# EAGLE design taserv2 (EAGLE 9.6.2)

## Sheet 1 of 3: Boost controller
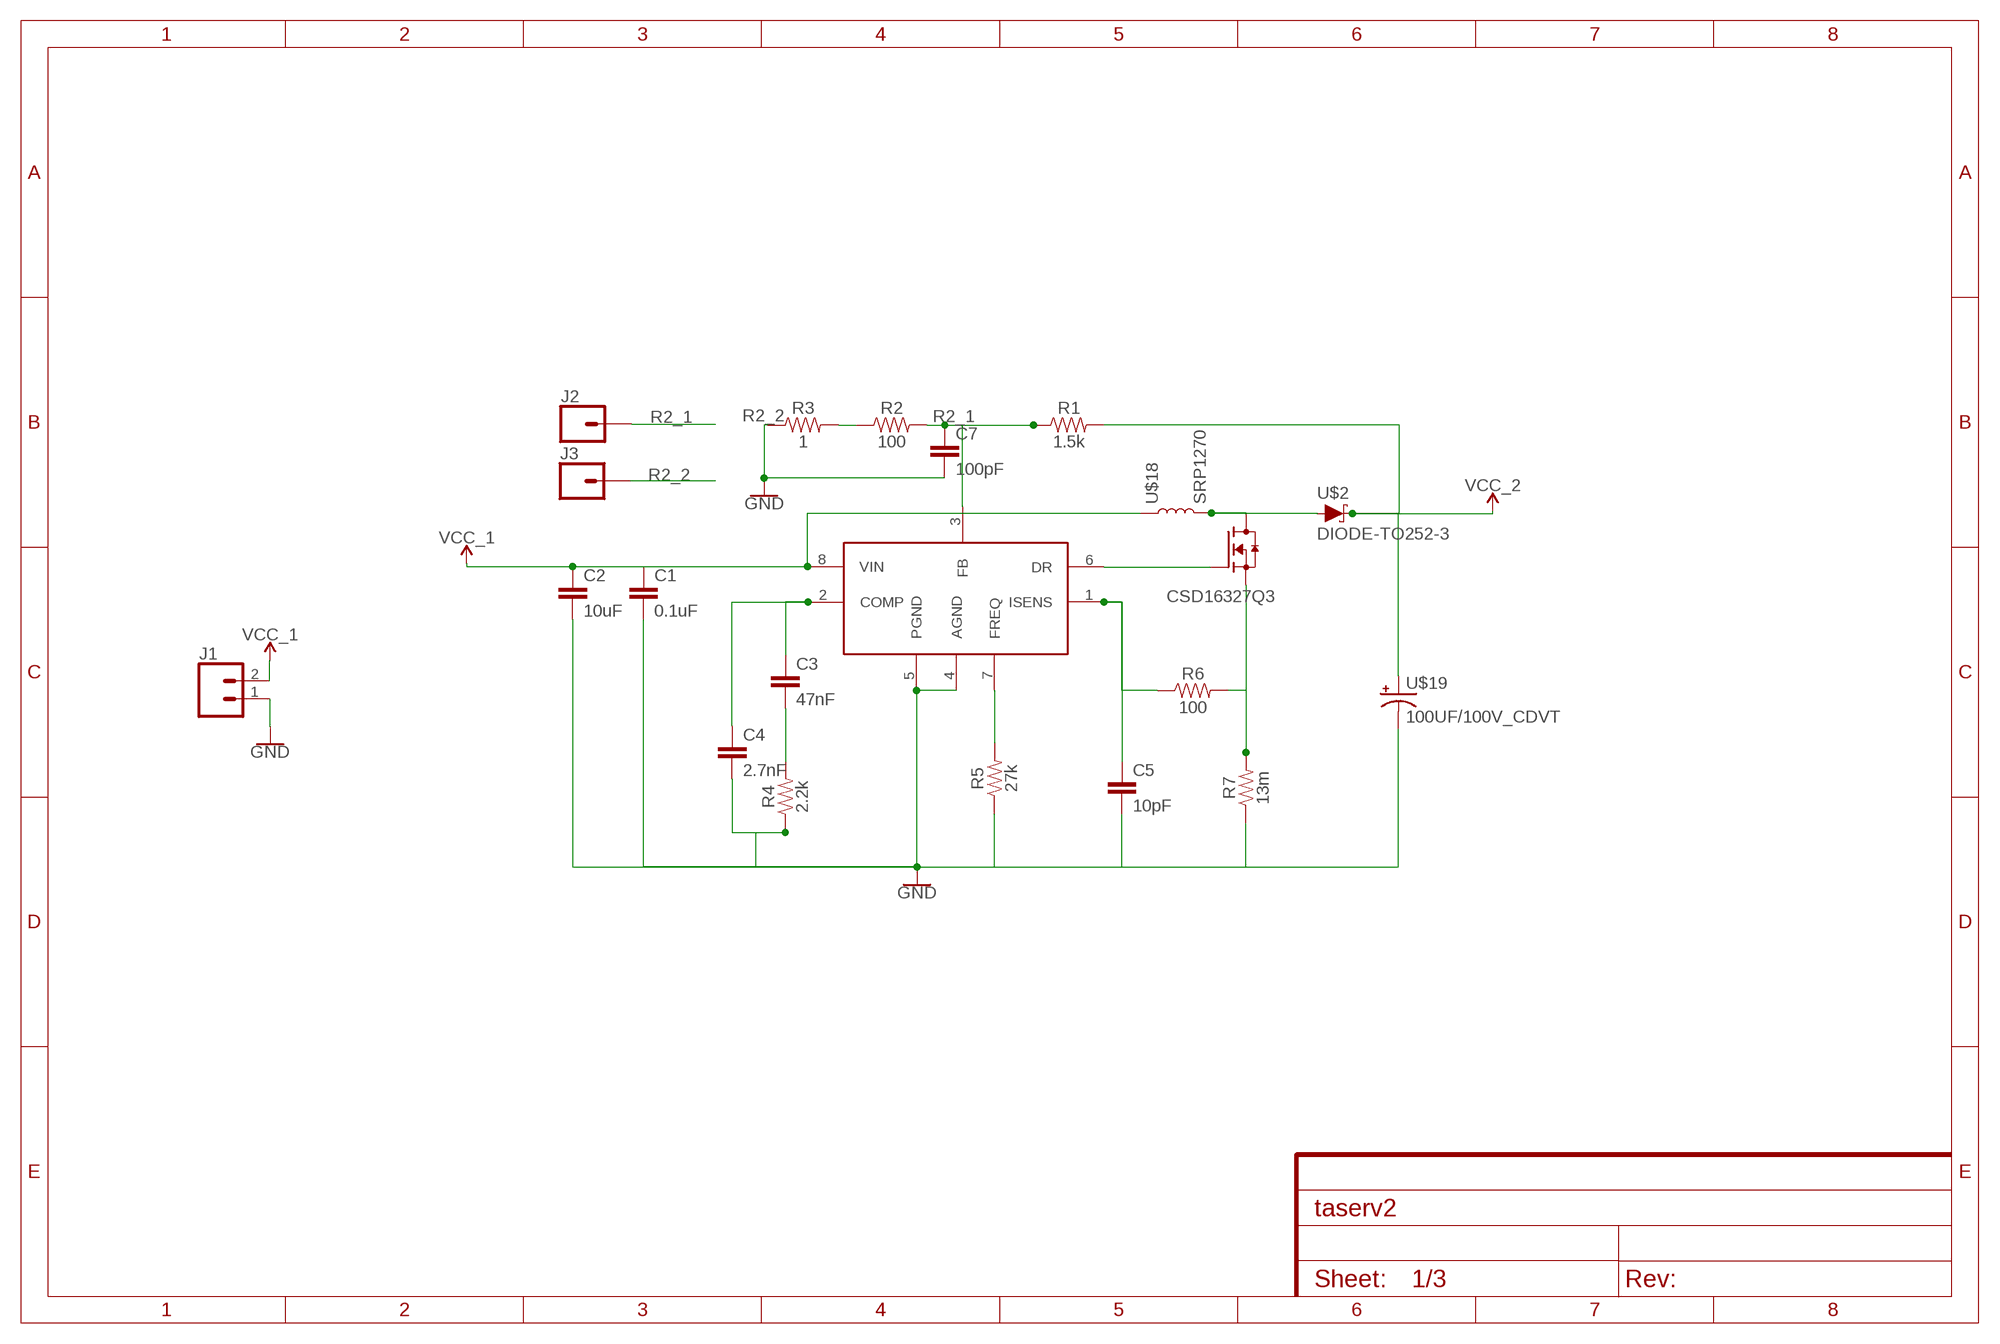
[diagram p0: schematic, sheet 1]

### Parts
C1  0.1uF  0.1UF-0603-25V-(+80/-20%)  [0603]
C2  10uF  0.1UF-0603-25V-(+80/-20%)  [0603]
C3  47nF  1.0UF-1206-50V-10%  [1206]
C4  2.7nF  1.0UF-0603-16V-10%  [0603]
C5  10pF  0.1UF-0603-25V-5%  [0603]
C7  100pF  0.1UF-0603-25V-(+80/-20%)  [0603]
J1  CONN_02LOCK  [1X02_LOCK]
J2  CONN_01  [1X01]
J3  CONN_01  [1X01]
Q1  CSD16327Q3  [TRANS_CSD16327Q3]
R1  1.5k  0.27OHM-0603-1/10W-1%  [0603]
R2  100  0.27OHM-0603-1/10W-1%  [0603]
R3  1  0.27OHM-0603-1/10W-1%  [0603]
R4  2.2k  2.2KOHM-0603-1/10W-1%  [0603]
R5  27k  2.2KOHM-0603-1/10W-1%  [0603]
R6  100  1.5KOHM-0603-1/10W-1%  [0603]
R7  13m  1.5KOHM-0603-1/10W-1%  [0603]
U$1  LM3478  [SOIC-8]
U$2  DIODE-TO252-3  [DPAK]
U$18  SRP1270  [SRP1270]
U$19  100UF/100V_CDVT  [100UF/100V_CDVT]

### Nets
GND: C1.2 C2.2 C4.2 C5.2 J1.1 R4.1 R5.1 R7.1 U$1.4(AGND) U$1.5(PGND) U$19.P$2(-) ; also sheet 2,3
N$1: C3.1 C4.1 U$1.2(COMP)
N$2: C3.2 R4.2
N$3: R5.2 U$1.7(FREQ)
N$4: R2.1 R3.2
N$6: Q1.4(G) U$1.6(DR)
N$7: Q1.1(S) Q1.2(S) Q1.3(S) R6.2 R7.2
N$8: C5.1 R6.1 U$1.1(ISENS)
N$10: Q1.5-8(D) U$2.1(A) U$2.3(A) U$18.P$2
R2_1: C7.1 J2.1 R1.1 R2.2 U$1.3(FB)
R2_2: C7.2 J3.1 R3.1 ; supply symbol labelled GND
VCC_1: C1.1 C2.1 J1.2 U$1.8(VIN) U$18.P$1
VCC_2: R1.2 U$2.4(C) U$19.P$1(+) ; also sheet 2

## Sheet 2 of 3: ZVS driver
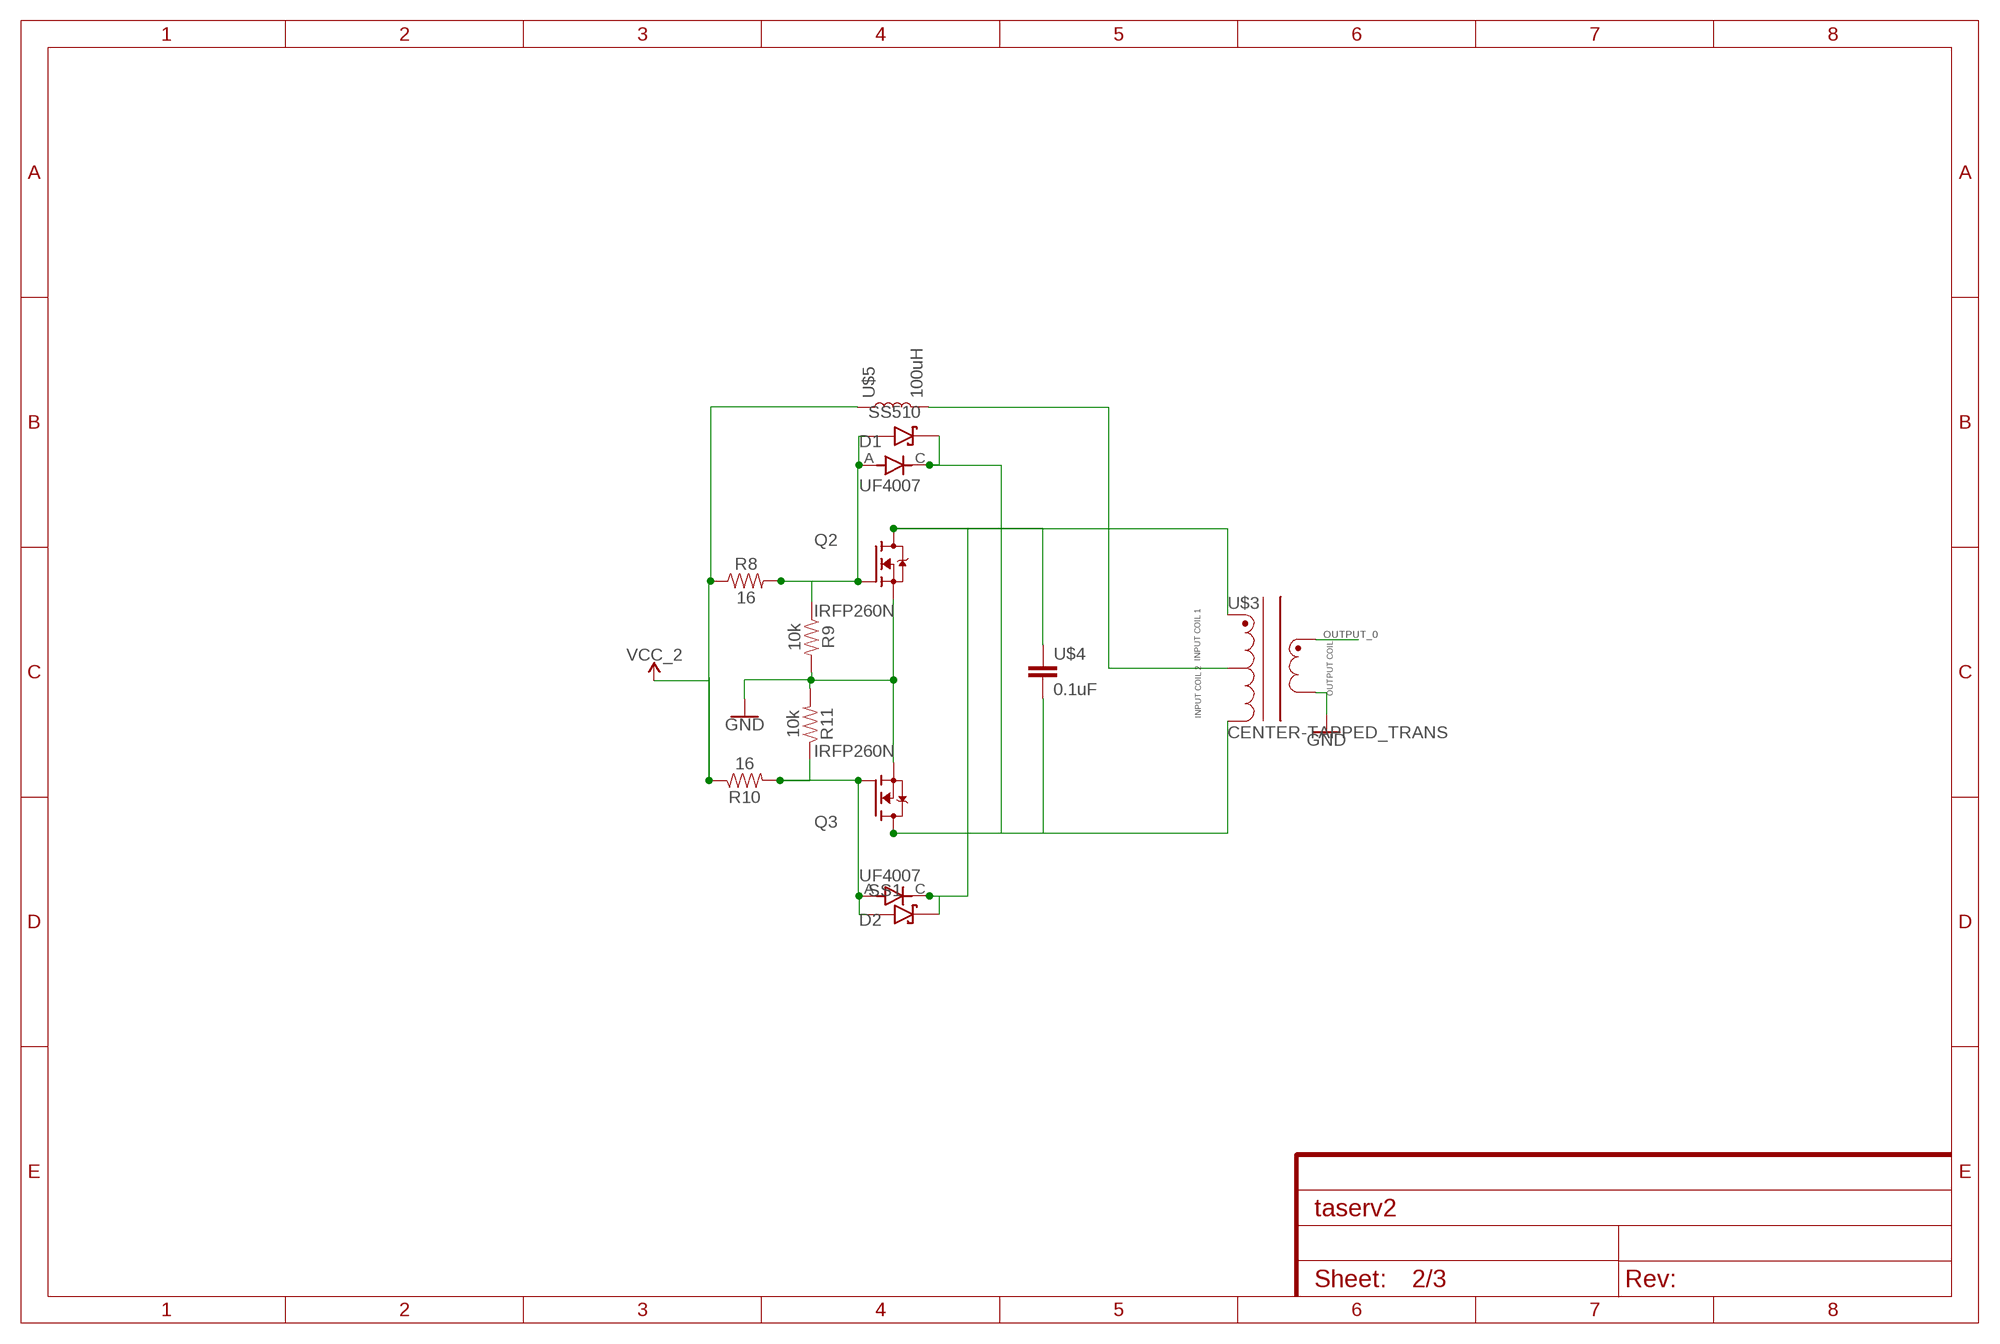
[diagram p1: schematic, sheet 2]

### Parts
D1  UF4007  [DIOAD1036W78L520D274]
D2  UF4007  [DIOAD1036W78L520D274]
Q2  IRFP260N  [TO545P1560X500X2460-3]
Q3  IRFP260N  [TO545P1560X500X2460-3]
R8  16  1KOHM-0603-1/10W-1%  [0603]
R9  10k  1KOHM-0603-1/10W-1%  [0603]
R10  16  1KOHM-0603-1/10W-1%  [0603]
R11  10k  1KOHM-0603-1/10W-1%  [0603]
SS1  MBRS340T3G  [DIOM7959X261N]
SS510  MBRS340T3G  [DIOM7959X261N]
U$3  CENTER-TAPPED_TRANS  [CENTER-TAPPED_TRANS]
U$4  0.1uF  MKP4  [MKP_CAP]
U$5  100uH  STANDARD_100UH  [1X04_LOCK]

### Nets
GND: Q2.3(S) Q3.3(S) R9.2 R11.2 U$3.5 ; also sheet 1,3
N$5: D2.C(K) Q2.2(D) SS1.C(K) U$3.3 U$4.1
N$9: D1.A Q2.1(G) R8.2 R9.1 SS510.A
N$11: D2.A Q3.1(G) R10.2 R11.1 SS1.A
N$14: D1.C(K) Q3.2(D) SS510.C(K) U$3.1 U$4.5
N$15: U$3.2 U$5.4
OUTPUT_0: U$3.4 ; also sheet 3
VCC_2: R8.1 R10.1 U$5.1 ; also sheet 1

### Notes on the sheet
- INPUT COIL 1
- OUTPUT COIL
- INPUT COIL 2

## Sheet 3 of 3: Cockroft-Walton
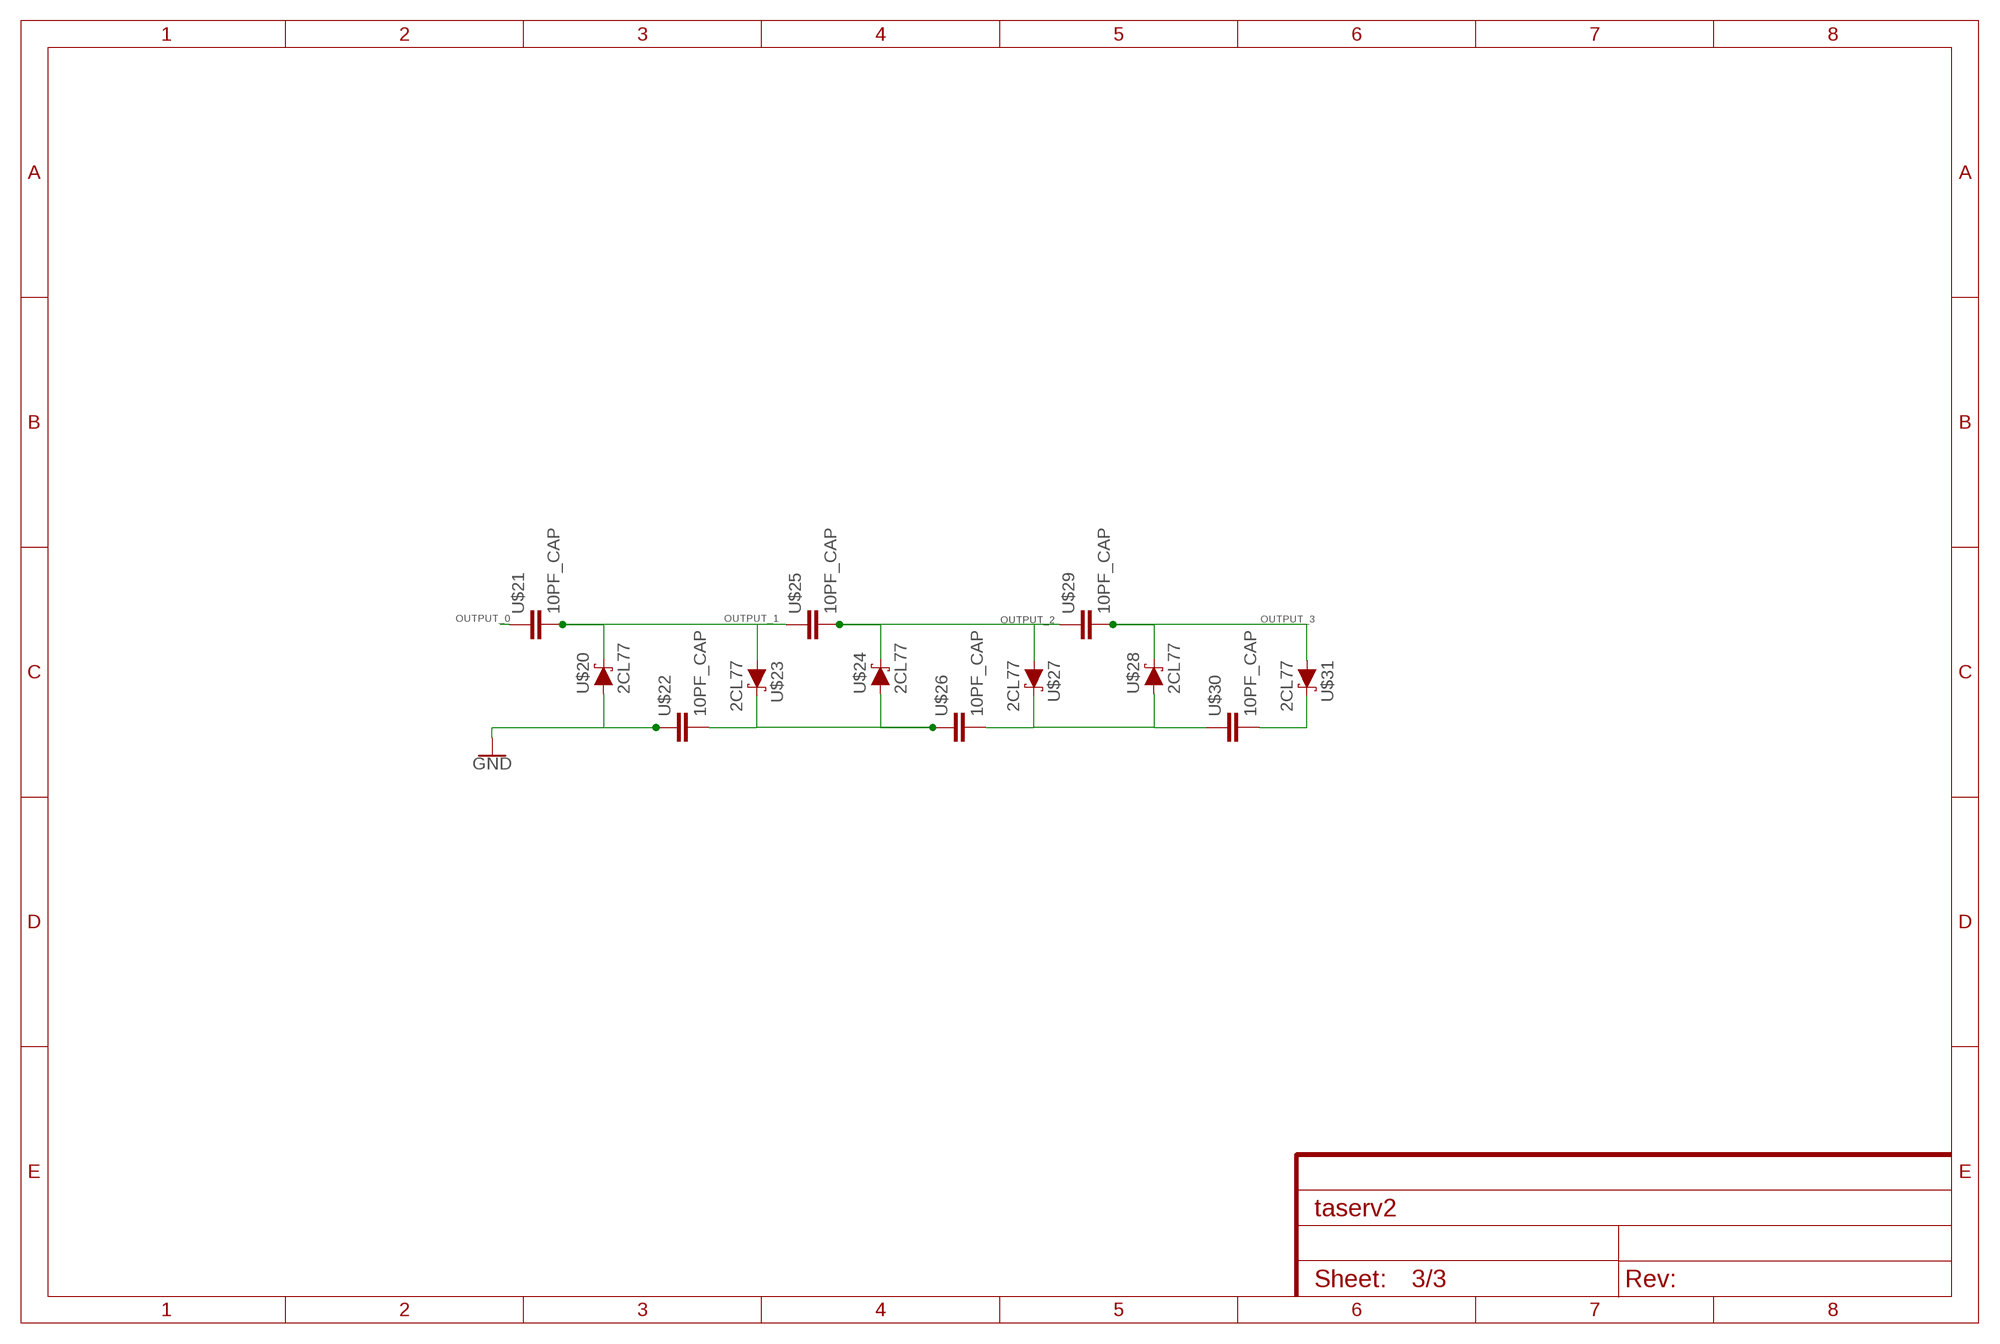
[diagram p2: schematic, sheet 3]

### Parts
U$20  2CL77  [2CL77]
U$21  10PF_CAP  [10PF_CAP]
U$22  10PF_CAP  [10PF_CAP]
U$23  2CL77  [2CL77]
U$24  2CL77  [2CL77]
U$25  10PF_CAP  [10PF_CAP]
U$26  10PF_CAP  [10PF_CAP]
U$27  2CL77  [2CL77]
U$28  2CL77  [2CL77]
U$29  10PF_CAP  [10PF_CAP]
U$30  10PF_CAP  [10PF_CAP]
U$31  2CL77  [2CL77]

### Nets
GND: U$20.1(A) U$22.1 ; also sheet 1,2
N$16: U$22.4 U$23.4(C) U$24.1(A) U$26.1
N$17: U$26.4 U$27.4(C) U$28.1(A) U$30.1
N$18: U$30.4 U$31.4(C)
OUTPUT_0: U$21.1 ; also sheet 2
OUTPUT_1: U$20.4(C) U$21.4 U$23.1(A) U$25.1
OUTPUT_2: U$24.4(C) U$25.4 U$27.1(A) U$29.1
OUTPUT_3: U$28.4(C) U$29.4 U$31.1(A)

## Library data of the parts
C1 = SparkFun-Capacitors:0.1UF: 0.1µF ceramic capacitors A capacitor is a passive two-terminal electrical component used to store electrical energy temporarily in an electric field.; PROD_ID: CAP-00810
C2 C7 = SparkFun-Capacitors:0.1UF: 0.1µF ceramic capacitors A capacitor is a passive two-terminal electrical component used to store electrical energy temporarily in an electric field.; PROD_ID: CAP-00810; VALUE: 0.1uF
C3 = SparkFun-Capacitors:1.0UF: 1µF ceramic capacitors A capacitor is a passive two-terminal electrical component used to store electrical energy temporarily in an electric field.; PROD_ID: CAP-09822; VALUE: 1.0uF
C4 = SparkFun-Capacitors:1.0UF: 1µF ceramic capacitors A capacitor is a passive two-terminal electrical component used to store electrical energy temporarily in an electric field.; PROD_ID: CAP-00868; VALUE: 1.0uF
C5 = SparkFun-Capacitors:0.1UF: 0.1µF ceramic capacitors A capacitor is a passive two-terminal electrical component used to store electrical energy temporarily in an electric field.; PROD_ID: CAP-08604; VALUE: 0.1uF
D1 D2 = SparkFun-DiscreteSemi:UF4007: Super Fast Rectifier Diodes Check prices <https://pricing.snapeda.com/parts/UF4007/onsemi/view-part?ref=eda>; AVAILABILITY: In Stock; DESCRIPTION: Diode Standard 1 V 1A Through Hole DO-41/DO-204AC; MF: onsemi; MP: UF4007; PACKAGE: None; PRICE: None; PURCHASE-URL: https://pricing.snapeda.com/search/part/UF4007/?ref=eda
J1 = SparkFun-Connectors:CONN_02: Multi connection point. Often used as Generic Header-pin footprint for 0.1 inch spaced/style header connections On any of the 0.1 inch spaced packages, you can populate with these: Break Away Headers - Straight <https://www.sparkfun.com/products/116> (PRT-00116) Break Away Male Headers - Right Angle <https://www.sparkfun.com/products/553> (PRT-00553) Female Headers <https://www.sparkfun.com/products/115> (PRT-00115) Break Away Headers - Machine Pin <https://www.sparkfun.com/products/117> (PRT-00117) Break Away Female Headers - Swiss Machine Pin <https://www.sparkfun.com/products/743> (PRT-00743) For SCREWTERMINALS and SPRING TERMINALS visit here: Screw Terimnals on SparkFun.com <https://www.sparkfun.com/search/results?term=Screw+Terminals> (5mm/3.5mm/2.54mm spacing) This device is also useful as a general connection point to wire up your design to another part of your project. Our various solder wires solder well into these plated through hole pads. Hook-Up Wire - Assortment (Stranded, 22 AWG) <https://www.sparkfun.com/products/11375> (PRT-11375) Hook-Up Wire - Assortment (Solid Core, 22 AWG) <https://www.sparkfun.com/products/11367> (PRT-11367) View the entire wire category on our website here <https://www.sparkfun.com/categories/141> Special notes: Molex polarized connector foot print use with: PRT-08233 with associated crimp pins and housings. 2.54_SCREWTERM for use with PRT-10571. 3.5mm Screw Terminal footprints for PRT-08084 5mm Screw Terminal footprints for use with PRT-08432
J2 J3 = SparkFun-Connectors:CONN_01: Single connection point. Often used as Generic Header-pin footprint for 0.1 inch spaced/style header connections On any of the 0.1 inch spaced packages, you can populate with these: Break Away Headers - Straight <https://www.sparkfun.com/products/116> (PRT-00116) Break Away Male Headers - Right Angle <https://www.sparkfun.com/products/553> (PRT-00553) Female Headers <https://www.sparkfun.com/products/115> (PRT-00115) Break Away Headers - Machine Pin <https://www.sparkfun.com/products/117> (PRT-00117) Break Away Female Headers - Swiss Machine Pin <https://www.sparkfun.com/products/743> (PRT-00743) This device is also useful as a general connection point to wire up your design to another part of your project. Our various solder wires solder well into these plated through hole pads. Hook-Up Wire - Assortment (Stranded, 22 AWG) <https://www.sparkfun.com/products/11375> (PRT-11375) Hook-Up Wire - Assortment (Solid Core, 22 AWG) <https://www.sparkfun.com/products/11367> (PRT-11367) View the entire wire category on our website here <https://www.sparkfun.com/categories/141> Special notes: SMTSO-256-ET is a "flush mount" nut for a 4-40 screw. We mostly use this on specialty testbeds; it is a nice way to connect hardware to your PCB at an adjustable hieght. Also note, the SNAP packages are for using a snappable style connector. We sell a baggie of snaps and they are also used on two LilyPad designs: Snap Assortment - 30 pack (male and female) <https://www.sparkfun.com/products/11347> (DEV-11347) LilyPad Arduino SimpleSnap <https://www.sparkfun.com/products/10941> (DEV-10941) LilyPad SimpleSnap Protoboard <https://www.sparkfun.com/products/10940> (DEV-10940)
Q1 = CSD16327Q3:CSD16327Q3: Check prices <https://pricing.snapeda.com/parts/CSD16327Q3/Texas%20Instruments/view-part?ref=eda>; AVAILABILITY: In Stock; DESCRIPTION: 25V, N ch NexFET MOSFET, single SON3x3, 4.8mOhm 8-VSON-CLIP -55 to 150; MF: Texas Instruments; MP: CSD16327Q3; PACKAGE: VSON-CLIP-8 Texas Instruments; PRICE: None; PURCHASE-URL: https://pricing.snapeda.com/search/part/CSD16327Q3/?ref=eda
Q2 Q3 = SparkFun-DiscreteSemi:IRFP260N: N-Channel 200V 50A (Tc) 300W (Tc) Through Hole TO-247AC Check prices <https://pricing.snapeda.com/parts/IRFP260N/Infineon%20Technologies/view-part?ref=eda>; AVAILABILITY: In Stock; DESCRIPTION: N-Channel 200 V 50A (Tc) 300W (Tc) Through Hole TO-247AC; MF: Infineon Technologies; MP: IRFP260N; PACKAGE: TO-247-3 Infineon Technologies; PRICE: None; PURCHASE-URL: https://pricing.snapeda.com/search/part/IRFP260N/?ref=eda
R1-R3 = SparkFun-Resistors:0.27OHM: 0.27Ω resistor A resistor is a passive two-terminal electrical component that implements electrical resistance as a circuit element. Resistors act to reduce current flow, and, at the same time, act to lower voltage levels within circuits. - Wikipedia; PROD_ID: RES-08787; VALUE: 0.27
R4 = SparkFun-Resistors:2.2KOHM: 2.2kΩ resistor A resistor is a passive two-terminal electrical component that implements electrical resistance as a circuit element. Resistors act to reduce current flow, and, at the same time, act to lower voltage levels within circuits. - Wikipedia; PROD_ID: RES-08272
R5 = SparkFun-Resistors:2.2KOHM: 2.2kΩ resistor A resistor is a passive two-terminal electrical component that implements electrical resistance as a circuit element. Resistors act to reduce current flow, and, at the same time, act to lower voltage levels within circuits. - Wikipedia; PROD_ID: RES-08272; VALUE: 2.2k
R6 R7 = SparkFun-Resistors:1.5KOHM: 1.5kΩ resistor A resistor is a passive two-terminal electrical component that implements electrical resistance as a circuit element. Resistors act to reduce current flow, and, at the same time, act to lower voltage levels within circuits. - Wikipedia; PROD_ID: RES-08306; VALUE: 1.5k
R8-R11 = SparkFun-Resistors:1KOHM: 1kΩ resistor A resistor is a passive two-terminal electrical component that implements electrical resistance as a circuit element. Resistors act to reduce current flow, and, at the same time, act to lower voltage levels within circuits. - Wikipedia; PROD_ID: RES-07856; VALUE: 1k
SS1 SS510 = MBRS340T3G:MBRS340T3G: Diode Schottky 40V 4A Surface Mount SMC (DO-214AB) Check prices <https://pricing.snapeda.com/parts/MBRS340T3G/ON%20Semiconductor/view-part?ref=eda>; AVAILABILITY: Good; DESCRIPTION: Diode Schottky 40V 4A Surface Mount SMC; MF: ON Semiconductor; MP: MBRS340T3G; PACKAGE: SMC-2 ON Semiconductor; PRICE: None; PURCHASE-URL: https://pricing.snapeda.com/search/part/MBRS340T3G/?ref=eda
U$1 = WT:LM3478
U$2 = SparkFun-DiscreteSemi:DIODE-TO252-3
U$3 = WT:CENTER-TAPPED_TRANS
U$4 = WT:MKP4
U$5 = WT:STANDARD_100UH
U$18 = SparkFun-Coils:SRP1270
U$19 = WT:100UF/100V_CDVT
U$20 U$23 U$24 U$27 U$28 U$31 = WT:2CL77
U$21 U$22 U$25 U$26 U$29 U$30 = WT:10PF_CAP

## Board
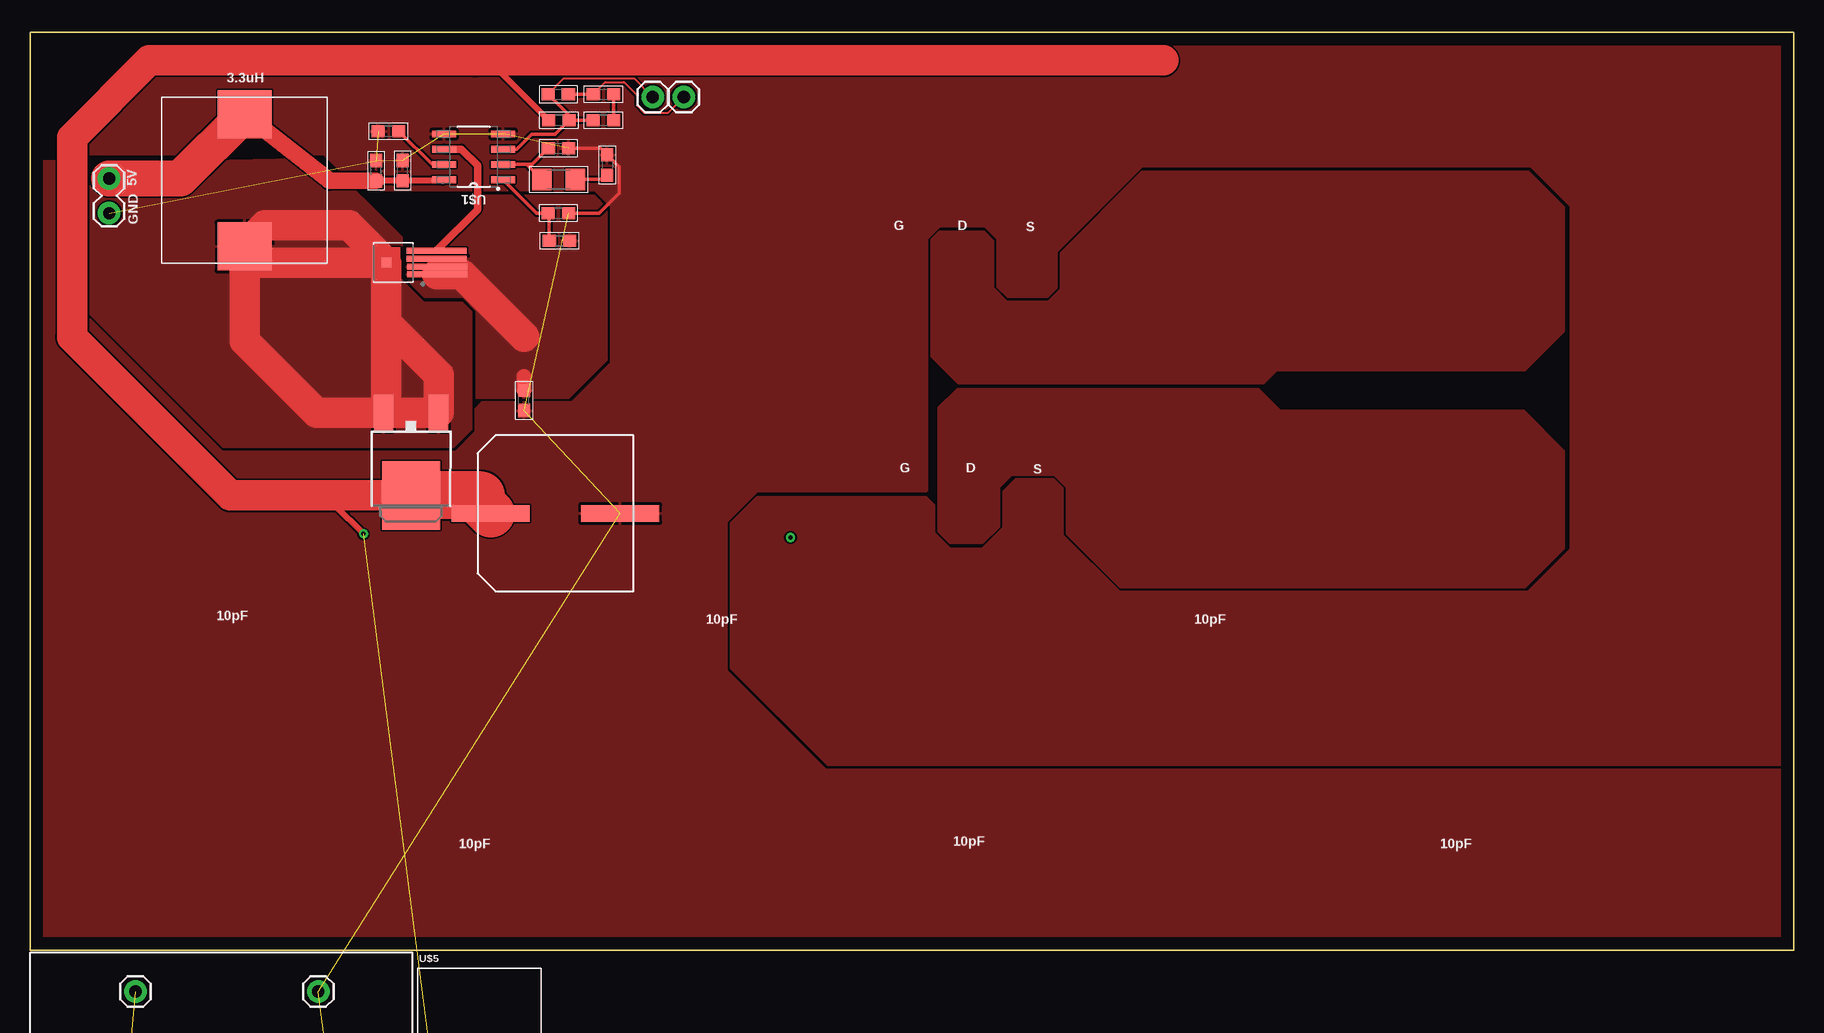
[diagram p3: board, top side]
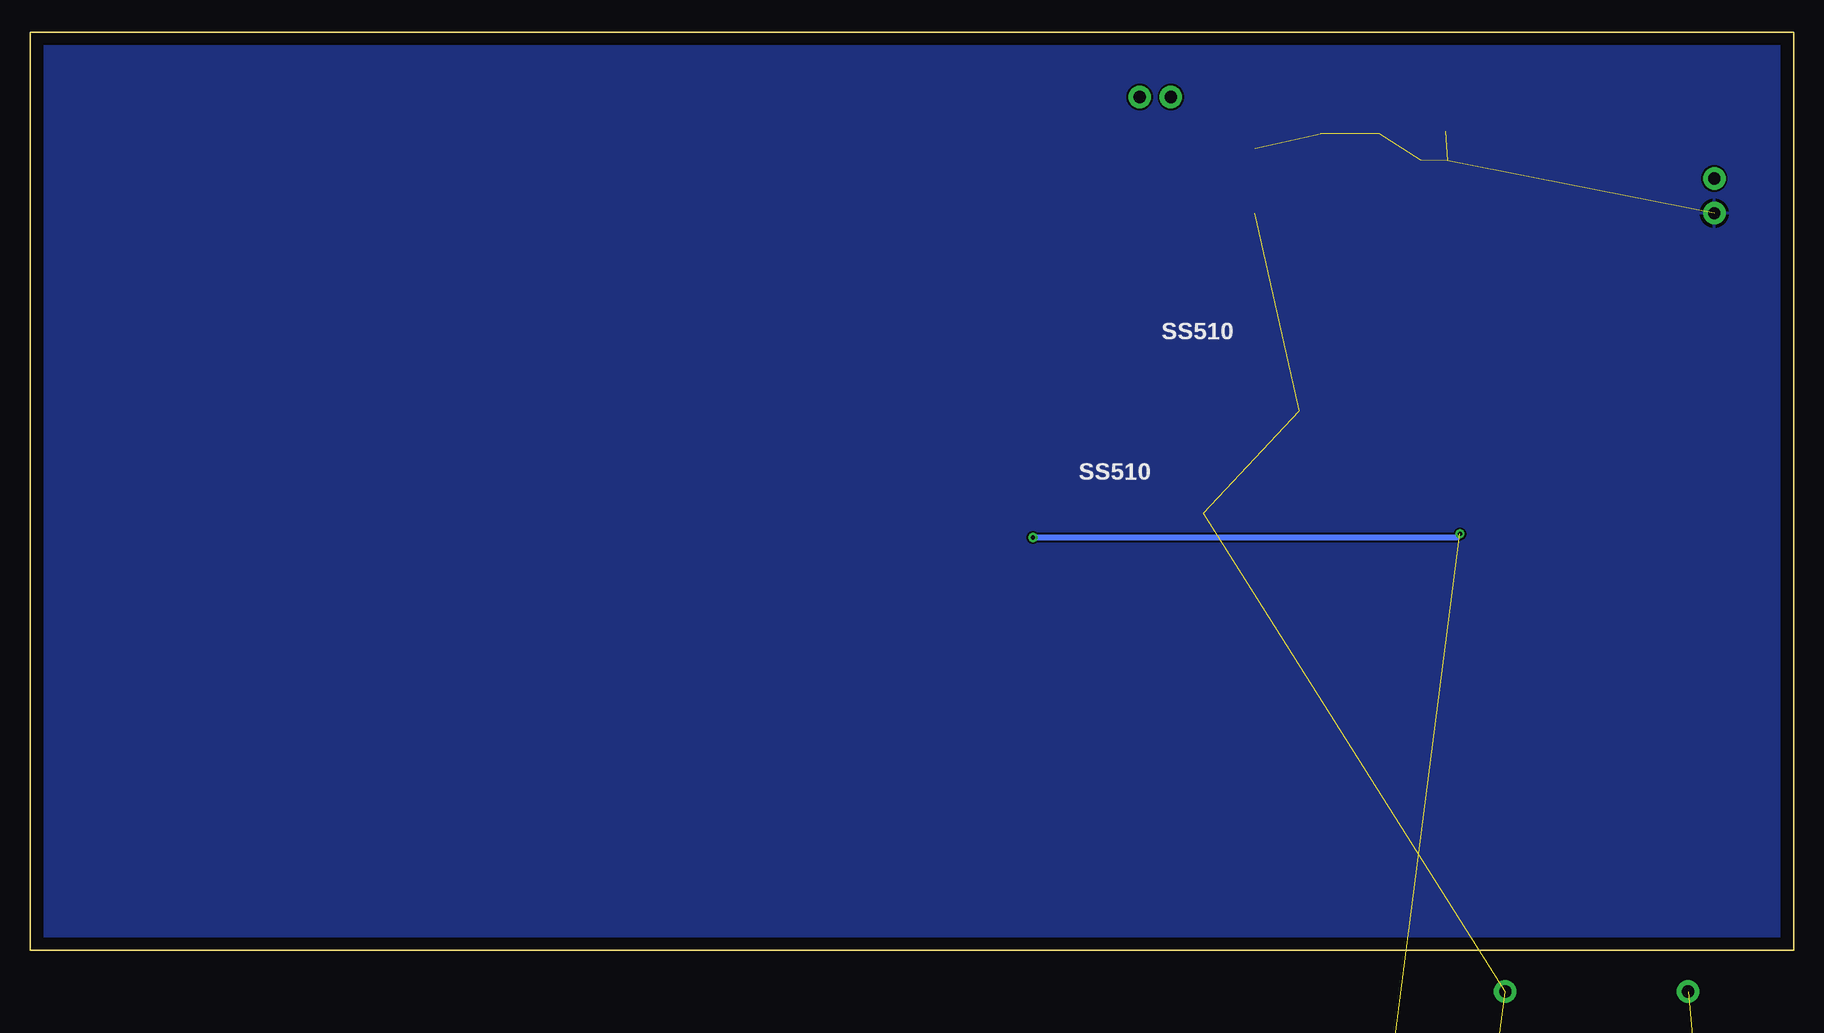
[diagram p4: board, bottom side, seen from below]

Size 147 x 76.5 mm. Coordinates in mm from the lower left corner, seen from the top.
Outline: 0,0 0,76.5 147,76.5 147,0 0,0
Copper layers (1*16): Top 0.035mm / dielectric 1.5mm / Bottom 0.035mm
Design rules "default *": minimum track width 6mil, minimum drill 0.35mm, track to track 6mil, track to pad 6mil, pad to pad 6mil, via to via 6mil, smd to smd 6mil, copper to edge 40mil, drill to drill 6mil, minimum pad ring 10mil, minimum via ring 8mil, stop-mask expansion 4mil, vias tented up to drill 0mil, thermal gap 10mil

### Footprints (pad centres in the part's own frame; a part is rotated, then mirrored left to right if it is on the bottom)
0603 = smd 1.1 x 1: 1 -0.85,0; 2 0.85,0
1206 = smd 1.6 x 1.8: 1 -1.4,0; 2 1.4,0
DIOAD1036W78L520D274 = drill 1.06: A 5.18,0 | drill 1.06 square: C -5.18,0
1X02_LOCK = drill 1.016 pad 1.88: 1 -0.178,0; 2 2.718,0
1X01 = drill 1.016 pad 1.88: 1 0,0
TRANS_CSD16327Q3 = smd 5 x 0.5: 1 -3.625,0.975; 2 -3.625,0.325; 3 -3.615,-0.325; 4 -3.615,-0.975 | smd 0.8 x 0.8: 5-8 0.595,0
TO545P1560X500X2460-3 = drill 1.76 pad 2.64 square: 1 -5.45,0 | drill 1.76 pad 2.64: 2 0,0; 3 5.45,0
DIOM7959X261N = smd 2.25 x 3.12: A 3.455,0; C -3.455,0
SOIC-8 = smd 1.981 x 0.559: 1 -2.464,1.905; 2 -2.464,0.635; 3 -2.464,-0.635; 4 -2.464,-1.905; 5 2.464,-1.905; 6 2.464,-0.635; 7 2.464,0.635; 8 2.464,1.905
DPAK = smd 1.6 x 3: 1 -2.28,-5.31; 3 2.28,-5.31 | smd 4.826 x 5.715: 4 0,1.588
CENTER-TAPPED_TRANS = drill 1.016 pad 1.88: 1 0,0; 2 7.62,0; 3 15.24,0; 4 -0.01,34.96; 5 15.23,34.96
MKP_CAP = drill 1.016 pad 1.88: 1 -2,2.127; 5 8.16,2.127
1X04_LOCK = drill 1.016 pad 1.88: 1 0,0.127; 4 7.62,-0.127
SRP1270 = smd 4 x 4.5: P$1 5.5,-0.1; P$2 -5.5,-0.1
100UF/100V_CDVT = smd 6.5 x 1.4: P$1 -5.4,0; P$2 5.4,0
2CL77 = drill 1.016 pad 1.88: 1 -8.96,-0.123; 4 9.66,-0.377
10PF_CAP = drill 1.016 pad 1.88: 1 0,0.127; 4 8.62,-0.127

### Placement (x,y rotation side)
C1  31.06,64.97 90 top
C2  28.86,64.96 90 top
C3  44.06,64.24 0 top
C4  44.05,66.84 0 top
C5  44.04,61.44 0 top
C7  44.03,71.34 0 top
D1  19.7,-55.5 0 top  (outside the outline)
D2  32.7,-55.5 0 top  (outside the outline)
J1  6.6,61.6 90 top
J2  51.9,71.1 0 top
J3  54.5,71.1 0 top
Q1  30.3,57.3 180 top
Q2  8.1,-46.4 0 top  (outside the outline)
Q3  24.3,-46.4 0 top  (outside the outline)
R1  44.08,69.16 180 top
R2  47.79,69.16 180 top
R3  47.8,71.34 0 top
R4  48.12,65.44 270 top
R5  29.88,68.26 0 top
R6  44.14,59.12 0 top
R7  41.18,45.83 90 top
R8  19.7,-63.7 0 top  (outside the outline)
R9  23,-63.7 0 top  (outside the outline)
R10  26.3,-63.7 0 top  (outside the outline)
R11  29.6,-63.7 0 top  (outside the outline)
SS1  37.8,-46.3 0 top  (outside the outline)
SS510  5.4,-56.9 0 top  (outside the outline)
U$1  36.98,66.12 180 top
U$2  31.77,39.49 180 top
U$3  8.8,-38.4 0 top  (outside the outline)
U$4  6,-67.3 0 top  (outside the outline)
U$5  33.6,-10.5 0 top  (outside the outline)
U$18  17.79,64.17 90 top
U$19  43.8,36.4 0 top
U$20  33.8,-92.4 0 top  (outside the outline)
U$21  1.9,-79.3 0 top  (outside the outline)
U$22  38.9,-79.3 0 top  (outside the outline)
U$23  10.8,-112.3 0 top  (outside the outline)
U$24  32.2,-112.3 0 top  (outside the outline)
U$25  14.3,-79.3 0 top  (outside the outline)
U$26  1.7,-99.2 0 top  (outside the outline)
U$27  10.8,-119.9 0 top  (outside the outline)
U$28  32.2,-119.9 0 top  (outside the outline)
U$29  26.7,-79.3 0 top  (outside the outline)
U$30  13.4,-99.2 0 top  (outside the outline)
U$31  10.3,-127.5 0 top  (outside the outline)

### Tracks (layer width: path | path; a pad name or v marks a point on that pad's centre or on a via)
GND  (15 unrouted)
  Top 0.305: C4.2 47.57,66.84 R4.1 49.1,65.31 49.1,63.1 47.44,61.44 C5.2
  pour Bottom: 0.1,75.8 0.1,76.5 0.9,76.5 147,76.5 147,20 147,0 0.5,0 0,0 0,0.9 0,75.7 0.1,75.7
  pour Top: 16,41.6 35.5,41.6 37.1,43.2 37.1,45.1 37.7,45.7 45.2,45.7 48.4,48.9 48.4,62 47.1,63.3 27.5,63.3 24.5,66.3 1.2,66.3 0,67.5 0,76.3 0.2,76.5 146.4,76.5 147,75.9 147,16.2 146.2,15.4 66.5,15.4 58.4,23.5 58.4,35.6 60.6,37.8 74.7,37.8 75.4,37.1 75.4,34.8 76.7,33.5 79.4,33.5 81.1,35.2 81.1,38.2 82.2,39.3 85.3,39.3 86.1,38.5 86.1,34.6 90.8,29.9 124.9,29.9 128.4,33.4 128.4,62 125.1,65.3 92.7,65.3 85.6,58.2 85.6,55.2 84.8,54.4 81.5,54.4 80.6,55.3 80.6,59.3 79.6,60.3 75.8,60.3 74.8,59.3 74.8,38.3 74.7,38.2 60.6,38.2 58.1,35.7 58.1,23.3 66.3,15.1 146.2,15.1 147,14.3 147,0.4 146.6,0 0.5,0 0,0.5 0,64.7 1.1,65.8 4.2,65.8 4.7,65.3 4.7,52.9
N$1
  Top 0.305: U$1.2 41.41,65.48 | 41.41,65.48 C3.1 | 41.41,65.48 41.84,65.48 C4.1
N$2
  Top 0.305: R4.2 47.77,64.24 C3.2
N$3
  Top 0.305: U$1.7 33.51,65.48 R5.2
N$4
  Top 0.305: R2.1 R3.2
N$5  (4 unrouted)
N$6
  Top 0.305: Q1.4 33.91,58.33
  Top 0.61: U$1.6 35.95,66.75 37.3,65.4 37.3,61.72 33.91,58.33
N$7
  Top 1.27: R7.2 41.18,47.82
  Top 2.54: Q1.1 35.98,56.33 41.18,51.12
  pour Top: 37.2,46 44.9,46 48.1,49.2 48.1,61.8 47,62.9 34.8,62.9 31.4,59.5 31.4,55.9 32.9,54.4 36.1,54.4 37.2,53.3
N$8
  Top 0.305: U$1.1 42.22,61.44 C5.1 43.29,61.34 R6.1
N$9  (4 unrouted)
N$10
  Top 2.54: Q1.5-8 19.25,57.3 U$18.P$2 | Q1.5-8 29.7,52.3 | 29.7,52.3 29.7,45.02 U$2.3 | U$2.3 U$2.1 34.05,47.96 29.7,52.3 | U$2.3 23.9,44.8 17.89,50.81 U$18.P$2 | Q1.5-8 26.6,60.4 19.62,60.4 U$18.P$2
  pour Top: 31,59.4 24.4,66 5,65.6 5,53 16.1,41.9 35.3,41.9 36.8,43.4 36.8,53.2 36,54 32.8,54 31,55.8
N$11  (4 unrouted)
N$12
  pour Top: 75.1,59.2 75.1,49.5 77.4,47.2 102.8,47.2 103.9,48.3 124.6,48.3 127.9,51.6 127.9,61.9 124.9,64.9 92.7,64.9 85.9,58.1 85.9,55.1 84.9,54.1 81.4,54.1 80.3,55.2 80.3,59.1 79.5,59.9 75.8,59.9
N$13
  pour Top: 77.3,46.8 75.7,45.2 75.7,34.9 76.7,33.9 79.4,33.9 80.8,35.3 80.8,38.6 81.8,39.6 85.4,39.6 86.4,38.6 86.4,34.7 90.9,30.2 124.6,30.2 127.9,33.5 127.9,41.6 124.5,45 104.2,45 102.4,46.8
N$14  (4 unrouted)
N$15  (1 unrouted)
N$16  (3 unrouted)
N$17  (3 unrouted)
N$18  (1 unrouted)
OUTPUT_0  (1 unrouted)
OUTPUT_1  (3 unrouted)
OUTPUT_2  (3 unrouted)
OUTPUT_3  (2 unrouted)
R2_1
  Top 0.152: C7.1 44.49,72.65 50.35,72.65 J2.1
  Top 0.305: R2.2 R1.1 | C7.1 44.93,69.59 R1.1 | R1.1 43.77,68 41.8,68 40.55,66.75 U$1.3
R2_2
  Top 0.152: R3.1 47.96,72.35 49.5,72.35 50.6,71.25 50.6,70.4 51.2,69.8 53.2,69.8 J3.1
  Top 0.305: R3.1 C7.2
VCC_1
  Top 0.508: U$1.8 34.42,64.12 C1.1 C2.1
  Top 1.37: C2.1 24.96,64.11 U$18.P$1
  Top 3: J1.2 12.54,64.32 U$18.P$1
VCC_2  (via drill 0.35)  (3 unrouted)
  Top 0.305: 31.6,37.91 U$2.4
  Top 0.508: 63.48,34.32 v63.4,34.4 | v27.8,34.7 25.4,37.1 25.4,37.91 | R1.2 38.24,74.15 37.1,74.15
  Top 2.54: 31.6,37.91 25.4,37.91 16.7,37.91 3.5,51.1 3.5,67.7 9.95,74.15 37.1,74.15 94.48,74.15
  Top 4: 31.6,37.91 37.59,37.91 37.59,37.22 U$19.P$1
  Bottom 0.508: v63.4,34.4 28.1,34.4 v27.8,34.7

### Text on the board
tNames: 3.3uH | 5V | GND | G | D | S | G | D | S | 10pF | 10pF | 10pF | 10pF | 10pF | 10pF
bNames: SS510 | SS510